# Altium schematic sheet yard-ice-power.SchDoc: Yard-Ice-Power
size 365 x 274 mm; Revision: 1.0; SheetNumber: 2; SheetTotal: 5
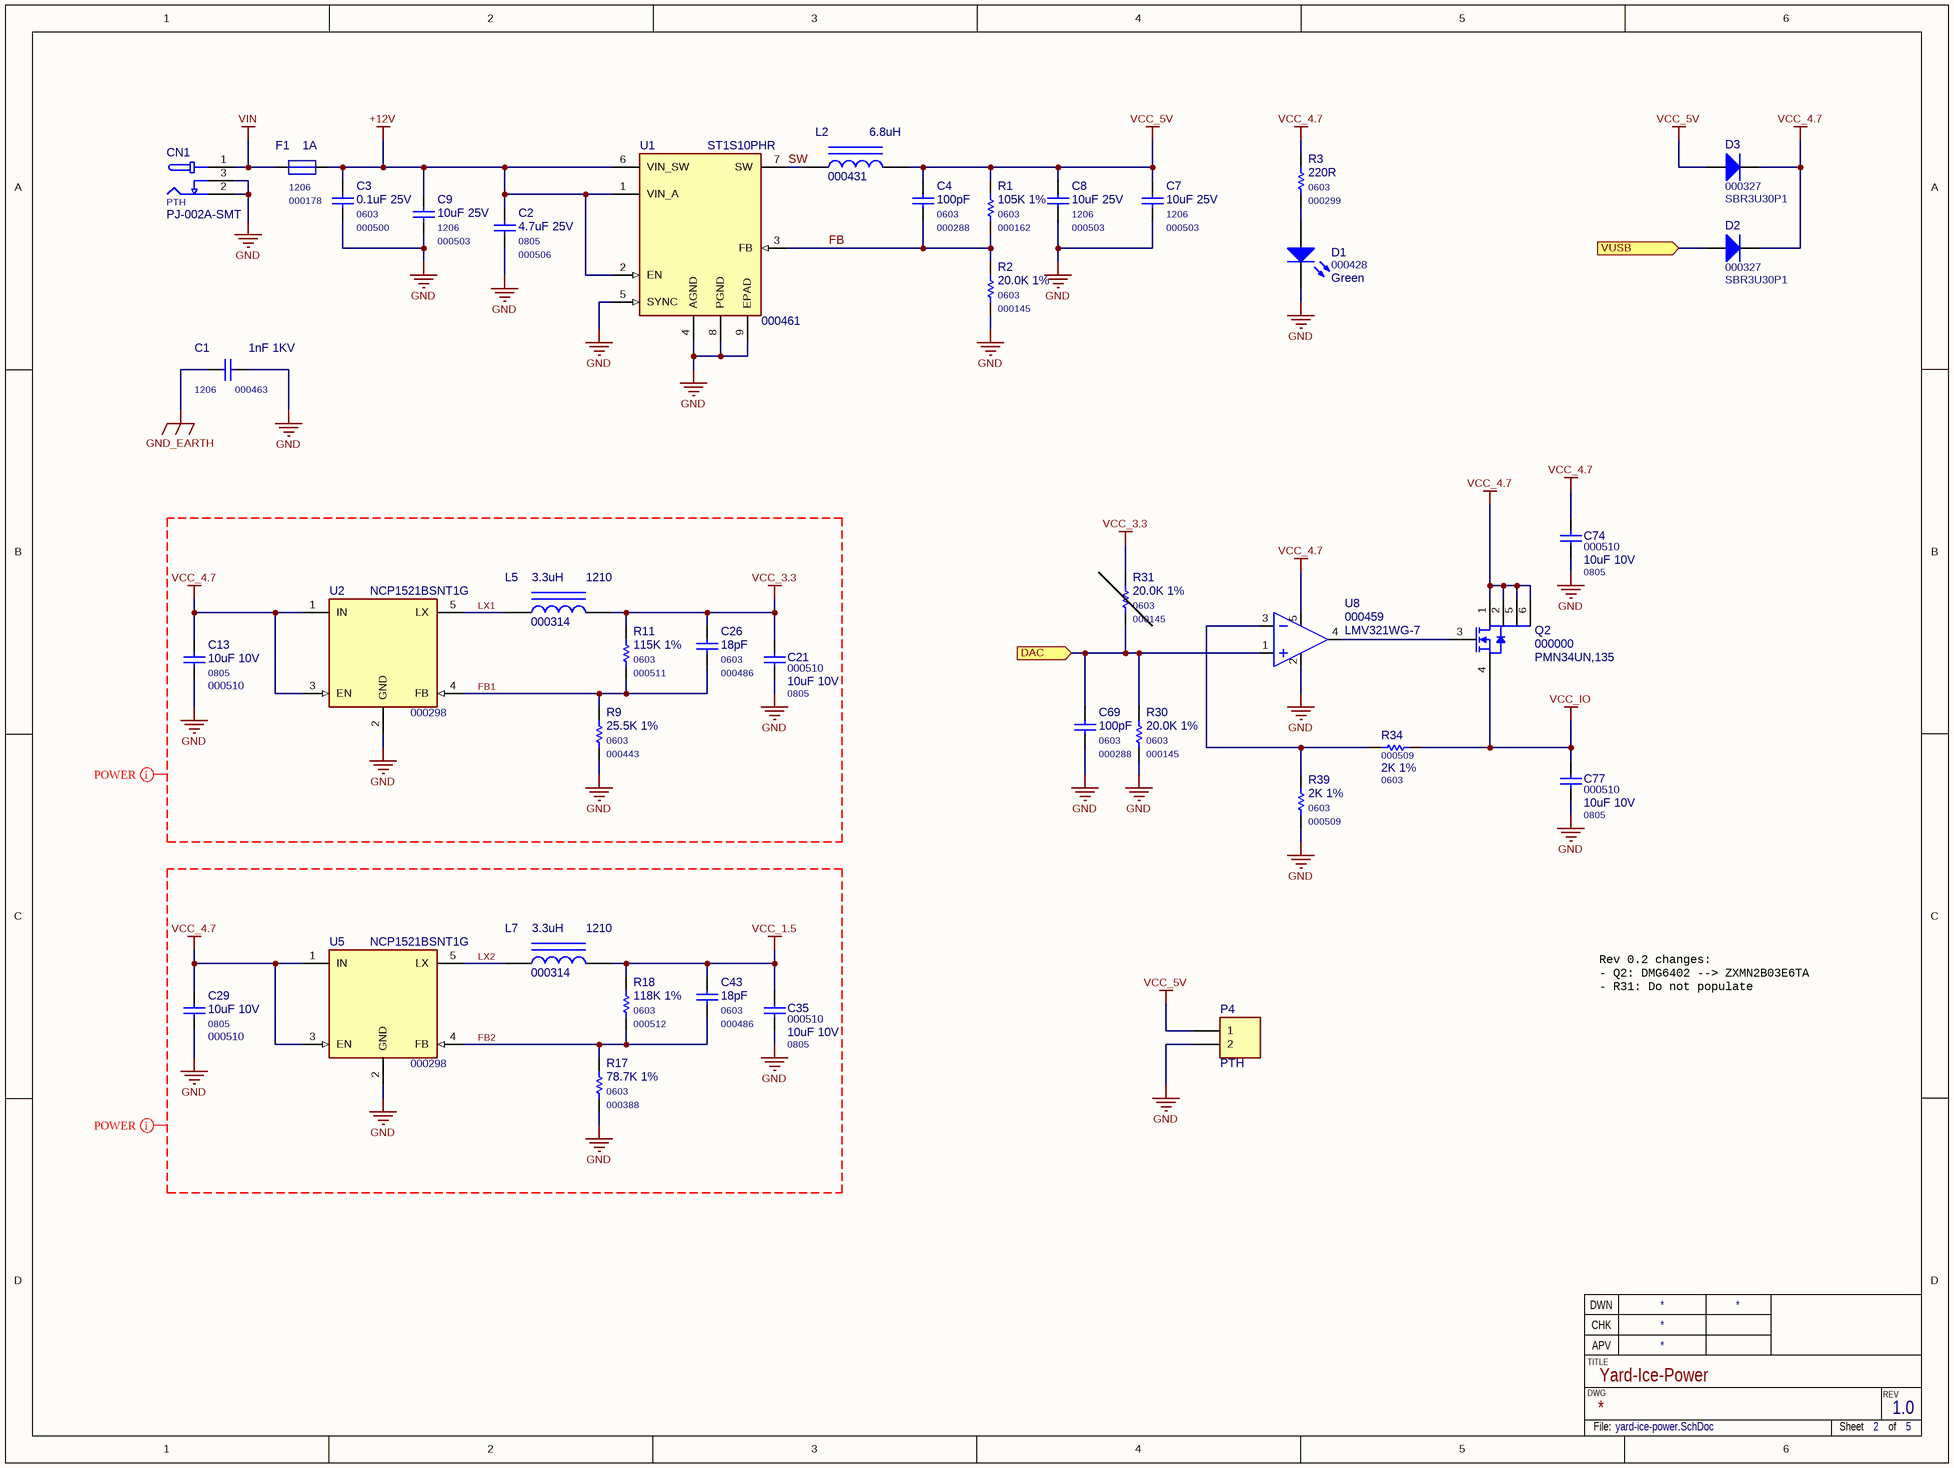
[diagram p0: yard-ice-power.SchDoc]

## Parts
C1  000463  value 1nF 1KV  Package: 1206  [C1206M]
C2  000506  value 4.7uF 25V  Package: 0805  [C0805M]
C3  000500  value 0.1uF 25V  Package: 0603  [C0603M]
C4  000288  value 100pF  Package: 0603  [C0603M]
C7  000503  value 10uF 25V  Package: 1206  [C1206M]
C8  000503  value 10uF 25V  Package: 1206  [C1206M]
C9  000503  value 10uF 25V  Package: 1206  [C1206M]
C13  000510  value 10uF 10V  Package: 0805  [C0805M]
C21  000510  value 10uF 10V  Package: 0805  [C0805M]
C26  000486  value 18pF  Package: 0603  [C0603M]
C29  000510  value 10uF 10V  Package: 0805  [C0805M]
C35  000510  value 10uF 10V  Package: 0805  [C0805M]
C43  000486  value 18pF  Package: 0603  [C0603M]
C69  000288  value 100pF  Package: 0603  [C0603M]
C74  000510  value 10uF 10V  Package: 0805  [C0805M]
C77  000510  value 10uF 10V  Package: 0805  [C0805M]
CN1  PTH  [PJ-002A-SMT]
D1  000428  value Green  [LED0805L LP]
D2  000327  value SBR3U30P1  [PowerDI 123]
D3  000327  value SBR3U30P1  [PowerDI 123]
F1  000178  value 1A  Package: 1206  [F1206L]
L2  000431  value 6.8uH  [L8.0MMX8.0MM]
L5  000314  value 3.3uH  Package: 1210  [L1210M]
L7  000314  value 3.3uH  Package: 1210  [L1210M]
P4  PTH  [TSW-102-07-G-S]
Q2  000000  value PMN34UN,135  [SOT-26]
R1  000162  value 105K 1%  Package: 0603  [R0603M]
R2  000145  value 20.0K 1%  Package: 0603  [R0603M]
R3  000299  value 220R  Package: 0603  [R0603M]
R9  000443  value 25.5K 1%  Package: 0603  [R0603M]
R11  000511  value 115K 1%  Package: 0603  [R0603M]
R17  000388  value 78.7K 1%  Package: 0603  [R0603M]
R18  000512  value 118K 1%  Package: 0603  [R0603M]
R30  000145  value 20.0K 1%  Package: 0603  [R0603M]
R31  000145  value 20.0K 1%  Package: 0603  [R0603M]
R34  000509  value 2K 1%  Package: 0603  [R0603M]
R39  000509  value 2K 1%  Package: 0603  [R0603M]
U1  000461  value ST1S10PHR  [PowerSO-8]
U2  000298  value NCP1521BSNT1G  [TSOP-5]
U5  000298  value NCP1521BSNT1G  [TSOP-5]
U8  000459  value LMV321WG-7  [SOT-25]

## Ports
DAC (in), VUSB (in)

## Nets
+12V: C2.1 C3.1 C9.1 F1.2 U1.1(VIN_A) U1.2(EN) U1.6(VIN_SW)
GND: C1.2 C2.2 C3.2 C7.2 C8.2 C9.2 C13.2 C21.2 C29.2 C35.2 C69.2 C74.2 C77.2 CN1.2 CN1.3 D1.2(K) P4.2 R2.1 R9.1 R17.1 R30.1 R39.1 U1.4(AGND) U1.5(SYNC) U1.8(PGND) U1.9(EPAD) U2.2(GND) U5.2(GND) U8.2(V-)
GND_EARTH: C1.1
VCC_1.5: C35.1 C43.1 L7.2 R18.2
VCC_3.3: C21.1 C26.1 L5.2 R11.2 R31.2
VCC_4.7: C13.1 C29.1 C74.1 D2.2(K) D3.2(K) Q2.1(D) Q2.2(D) Q2.5(D) Q2.6(D) R3.2 U2.1(IN) U2.3(EN) U5.1(IN) U5.3(EN) U8.5(V+)
VCC_5V: C4.1 C7.1 C8.1 D3.1(A) L2.2 P4.1 R1.2
VCC_IO: C77.1 Q2.4(S) R34.1
VIN: CN1.1 F1.1
DAC: C69.1 R30.2 R31.1 U8.1(IN+) ; port DAC
FB: C4.2 R1.1 R2.2 U1.3(FB)
FB1: C26.2 R9.2 R11.1 U2.4(FB)
FB2: C43.2 R17.2 R18.1 U5.4(FB)
LX1: L5.1 U2.5(LX)
LX2: L7.1 U5.5(LX)
SW: L2.1 U1.7(SW)
VUSB: D2.1(A) ; port VUSB
NetD1_1: D1.1(A) R3.1
NetQ2_3: Q2.3(G) U8.4(OUT)
NetR34_2: R34.2 R39.2 U8.3(IN-)

## Layout directives
net class POWER: FB1, FB2, GND, LX1, LX2, VCC_1.5, VCC_3.3, VCC_4.7

## Notes on the sheet
- Rev 0.2 changes:
  - Q2: DMG6402 --> ZXMN2B03E6TA
  - R31: Do not populate
- TITLE
- CHK
- DWN
- APV
- DWG
- REV
- File:
- Sheet
- of

## Library data of the parts
C1 = C1206: SMD Ceramic Chip Capacitor - 1206; PN: 000463
C2 = C0805: SMD Ceramic Chip Capacitor - 0805 - X7R; MF: Taiyo Yuden; MF PN: TMK212AB7475KG-T; PN: 000506
C3 = C0603: SMD Ceramic Chip Capacitor - 0603 - X7R; MF PN: C1608X7R1E104K; MF: TDK; PN: 000500
C4 C26 C43 C69 = C0603: SMD Ceramic Chip Capacitor - 0603
  C4 C69: PN: 000288
  C26 C43: PN: 000486
C7-C9 = C1206: SMD Ceramic Chip Capacitor - 1206 - X7R; MF PN: TMK316B7106KL-TD; MF: Taiyo Yuden; PN: 000503
C13 C21 C29 C35 = C0805: SMD Ceramic Chip Capacitor - 0805 - X7R; MF PN: C2012X7R1A106K; MF: TDK; PN: 000510
C74 C77 = C0805: SMD Ceramic Chip Capacitor - 0805 - X7R; MF PN: C2012X7R1A106K; PN: TDK; PN: 000510; MF: TDK
CN1 = PJ-002A-SMT: Low Voltage Power Supply Connector; MF: CUI INC; PN: PTH; MF PN: PJ-002A-SMT; Package: SMT; Value: PJ-002A-SMT
D1 = LED0805LP: LED SMD 0805; Package: 0805; PN: 000428
D2 D3 = SBR3U30P1: Super Barrier Rectifier; MF: Diodes Inc; PN: 000327; Package: PowerDI 123
F1 = F1206: SMD Fuse, 1A, Slow, 63VDC, 1206; MF: Bel Fuse Inc; MF PN: C1S 1; PN: 000178
L2 = L8.0X8.0: SMT Power Inductor 8.0X8.0mm; MF: Taiyo Yuden; MF PN: NRS8040T6R8NJGJ; PN: 000431; Package: 8.0x8.0mm
L5 L7 = L1210: SMD Wire Wound Inductor -  1210 (3225 metric); MF: Murata; MF PN: LQH32PN3R3NN0L; PN: 000314
P4 = Header 2: Header, 2-Pin; Value: 2x1; PN: PTH; Package: PTH
Q2 = PMN34UN,135: N-Channel MOSFET 30V 4.9A 6TSOP; PN: 000000; Package: SOT23-6; ExtraInfo: *
R1-R3 R9 R11 R17 R18 R30 R31 R34 R39 = R0603: SMD Chip Resistor - 0603
  R1: PN: 000162
  R2 R30 R31: PN: 000145
  R3: PN: 000299
  R9: PN: 000443
  R11: PN: 000511
  R17: PN: 000388
  R18: PN: 000512
  R34 R39: PN: 000509
U1 = ST1S10: 3A, 900kHZ, monolithic synchronous step-down regulator; MF: ST; PN: 000461; Package: SOIC-8
U2 U5 = NCP1521BSNT1G: 1.5 MHz, 600 mA Step-Down  DC-DC Converter; MF: ON Semiconductor; PN: 000298; Package: SOT-23-5
U8 = LMV321WG-7: General Purpose, Low Voltage, Rail-to-Rail Output Operational Amplifier; MF: Diodes Inc; Package: SOT25; PN: 000459